# EAGLE design triface-final (EAGLE 7.2.0)
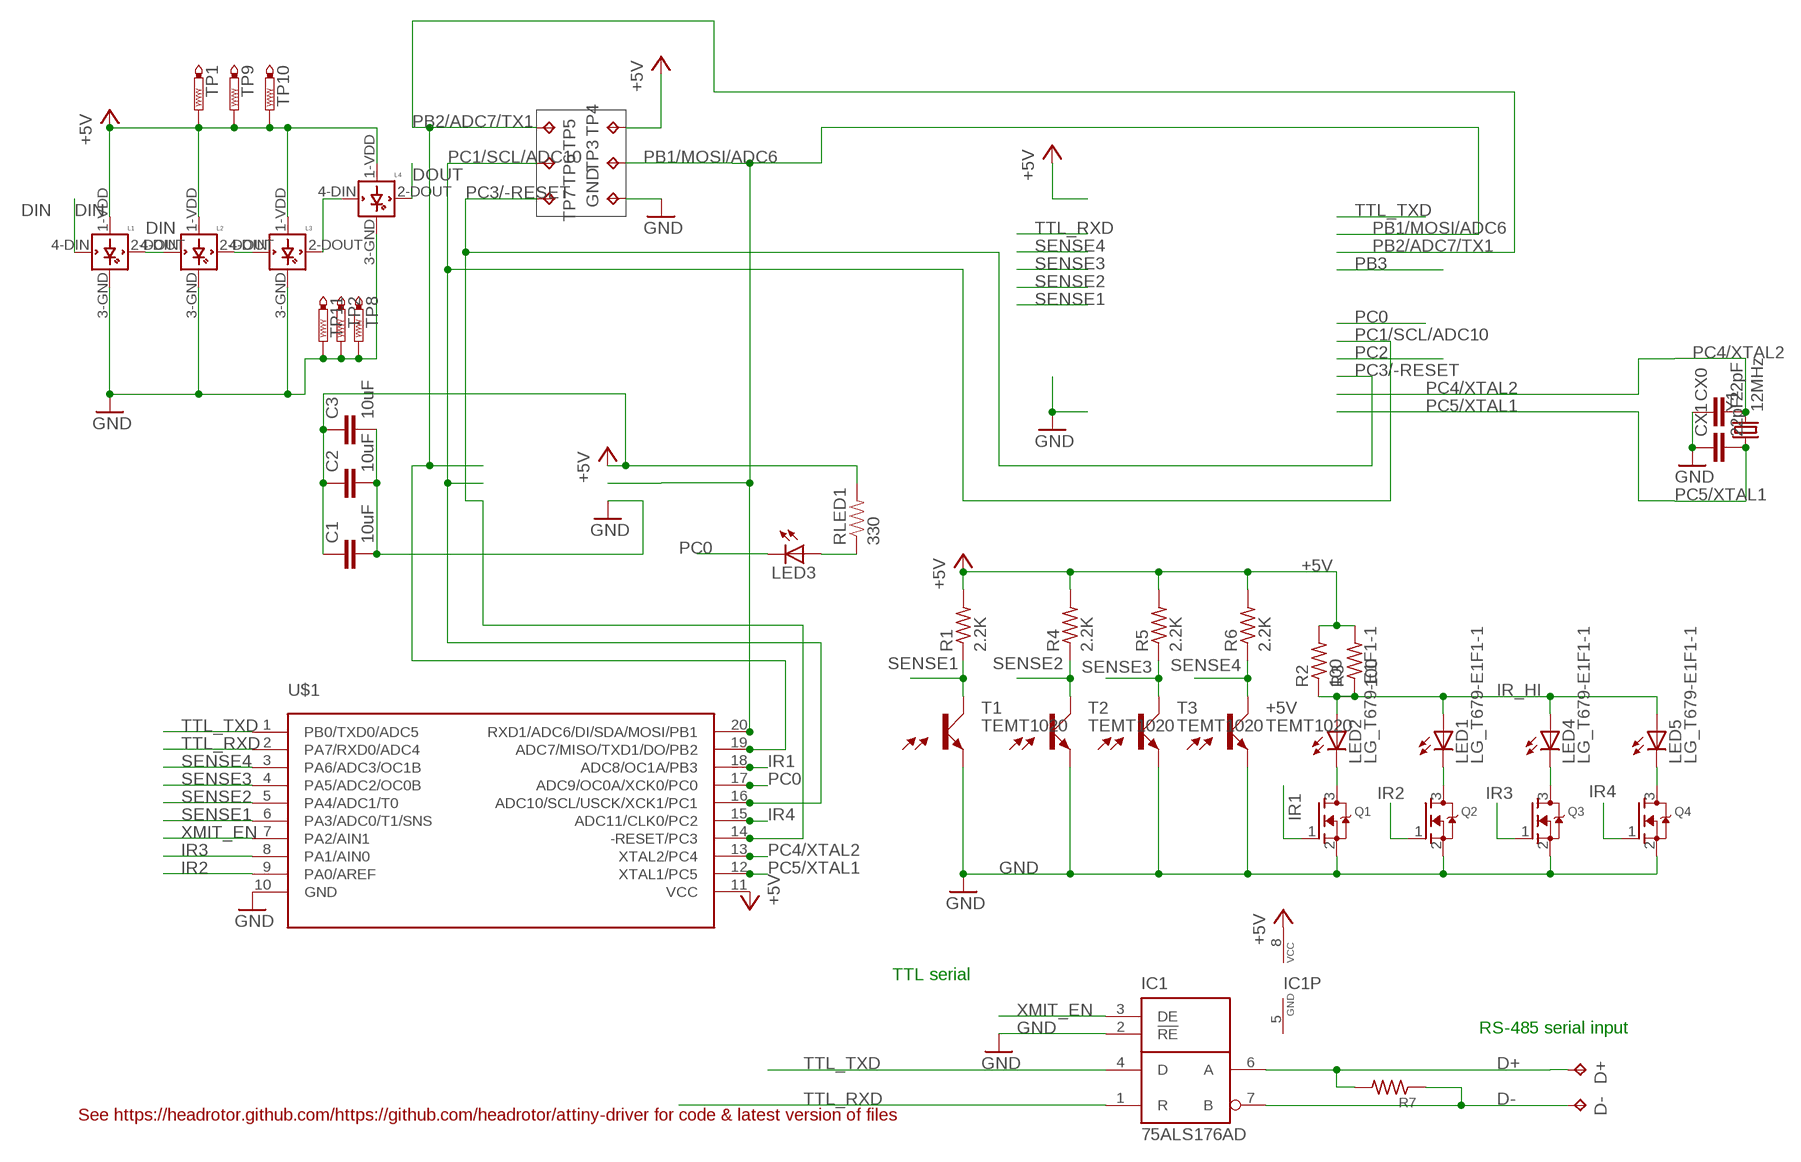
[diagram p0: schematic, sheet 1]

## Parts
+5V  TEMT1020  [TEMT1020]
C1  10uF  C-EUC0805  [C0805]
C2  10uF  C-EUC0805  [C0805]
C3  10uF  C-EUC0805  [C0805]
CX0  22pF  C-EUC0603  [C0603]
CX1  22pF  C-EUC0603  [C0603]
D+  TPTP14R  [TP14R]
D-  TPTP14SQ  [TP14SQ]
GND  TPTP12SQ  [TP12SQ]
IC1  75ALS176AD  [SO-08]
L1  WS2812B  [WS2812B]
L2  WS2812B  [WS2812B]
L3  WS2812B  [WS2812B]
L4  WS2812B  [WS2812B]
LED1  LG_T679-E1F1-1  [PLCC2]
LED2  LG_T679-E1F1-1  [PLCC2]
LED3  LED0603  [LED-0603]
LED4  LG_T679-E1F1-1  [PLCC2]
LED5  LG_T679-E1F1-1  [PLCC2]
Q1  MOSFET-NREFLOW  [SOT23]
Q2  MOSFET-NREFLOW  [SOT23]
Q3  MOSFET-NREFLOW  [SOT23]
Q4  MOSFET-NREFLOW  [SOT23]
R1  2.2K  R-US_R0603  [R0603]
R2  100  R-US_R0805  [R0805]
R3  100  R-US_R0805  [R0805]
R4  2.2K  R-US_R0603  [R0603]
R5  2.2K  R-US_R0603  [R0603]
R6  2.2K  R-US_R0603  [R0603]
R7  330  R-US_R0603  [R0603]
RLED1  330  RESISTOR0603-RES  [0603-RES]
T1  TEMT1020  [TEMT1020]
T2  TEMT1020  [TEMT1020]
T3  TEMT1020  [TEMT1020]
TP1  PTR1TP14SQ  [TP14SQ]
TP2  PTR1B2,54  [B2,54]
TP3  TPTP12R  [TP12R]
TP4  TPTP12R  [TP12R]
TP5  TPTP12R  [TP12R]
TP6  TPTP12R  [TP12R]
TP7  TPTP12R  [TP12R]
TP8  PTR1B2,54  [B2,54]
TP9  PTR1TP14SQ  [TP14SQ]
TP10  PTR1TP14SQ  [TP14SQ]
TP11  PTR1B2,54  [B2,54]
U$1  ATTINY1634  [SOIC20]
Y1  12MHz  CRYSTAL5X3  [CRYSTAL-SMD-5X3]

## Nets
+5V [POWER]: C1.1 C2.1 C3.1 IC1.8(VCC) L1.1-VDD(VDD) L2.1-VDD(VDD) L3.1-VDD(VDD) L4.1-VDD(VDD) R1.2 R2.2 R3.2 R4.2 R5.2 R6.2 RLED1.2 TP1.TP TP4.TP TP9.TP TP10.TP U$1.11(VCC)
D+: D+.TP IC1.6(A) R7.2
D-: D-.TP IC1.7(B) R7.1
DIN: L1.4-DIN(DIN)
DOUT: L4.2-DOUT(DOUT)
GND: +5V.E C1.2 C2.2 C3.2 CX0.1 CX1.1 GND.TP IC1.2(!RE) L1.3-GND(GND) L2.3-GND(GND) L3.3-GND(GND) L4.3-GND(GND) Q1.2(S) Q2.2(S) Q3.2(S) Q4.2(S) T1.E T2.E T3.E TP2.TP TP8.TP TP11.TP U$1.10(GND)
IR1: Q1.1(G) U$1.18(ADC8/OC1A/PB3)
IR2: Q2.1(G) U$1.9(PA0/AREF)
IR3: Q3.1(G) U$1.8(PA1/AIN0)
IR4: Q4.1(G) U$1.15(ADC11/CLK0/PC2)
IR_HI: LED1.A LED2.A LED4.A LED5.A R2.1 R3.1
N$2: LED2.C Q1.3(D)
N$4: LED1.C Q2.3(D)
N$5: L1.2-DOUT(DOUT) L2.4-DIN(DIN)
N$6: LED3.A RLED1.1
N$7: L2.2-DOUT(DOUT) L3.4-DIN(DIN)
N$8: L3.2-DOUT(DOUT) L4.4-DIN(DIN)
N$9: LED4.C Q3.3(D)
N$10: LED5.C Q4.3(D)
PB1/MOSI/ADC6: TP3.TP U$1.20(RXD1/ADC6/DI/SDA/MOSI/PB1)
PB2/ADC7/TX1: TP5.TP U$1.19(ADC7/MISO/TXD1/DO/PB2)
PC0: LED3.C U$1.17(ADC9/OC0A/XCK0/PC0)
PC1/SCL/ADC10: TP6.TP U$1.16(ADC10/SCL/USCK/XCK1/PC1)
PC3/-RESET: TP7.TP U$1.14(-RESET/PC3)
PC4/XTAL2: CX0.2 U$1.13(XTAL2/PC4) Y1.3
PC5/XTAL1: CX1.2 U$1.12(XTAL1/PC5) Y1.1
SENSE1: R1.1 T1.C U$1.6(PA3/ADC0/T1/SNS)
SENSE2: R4.1 T2.C U$1.5(PA4/ADC1/T0)
SENSE3: R5.1 T3.C U$1.4(PA5/ADC2/OC0B)
SENSE4: +5V.C R6.1 U$1.3(PA6/ADC3/OC1B)
TTL_RXD: IC1.1(R) U$1.2(PA7/RXD0/ADC4)
TTL_TXD: IC1.4(D) U$1.1(PB0/TXD0/ADC5)
XMIT_EN: IC1.3(DE) U$1.7(PA2/AIN1)

## Notes on the sheet
- TTL serial
- RS-485 serial input
- See https://headrotor.github.com/https://github.com/headrotor/attiny-driver for code & latest version of files

## Power pins joined to a net without a drawn wire
GND: IC1.5(GND)

## Library data of the parts
+5V T1-T3 = badge:TEMT1020
C1-C3 CX0 CX1 = rcl:C-EU: CAPACITOR, European symbol
D+ D- GND TP3-TP7 = testpad:TP: Test pad
IC1 = texas:75ALS176: DIFFERENTIAL BUS TRANSCEIVERS TIA/EIA-422-B, TIA/EIA-422-B + TIA/EIA-422-B TIA/EIA-422-B Operate at Data Rates up to 35 Mbaud Source: http://focus.ti.com/lit/ds/symlink/sn65als176.pdf
L1-L4 = adafruit:WS2812B
LED1 LED2 LED4 LED5 = led:*_T679-?-1: LC TOPLED® Low Current LED Source: http://catalog.osram-os.com .. LG_LS_LY_T679_OBS.pdf; COLOR: green
LED3 = SparkFun-LED:LED: LEDs Standard schematic elements and footprints for 5mm, 3mm, 1206, and 0603 sized LEDs. 5mm - Spark Fun Electronics SKU : COM-00529 (and others)
Q1-Q4 = adafruit:MOSFET-N: N-Channel Mosfet 2N7002E - 60V 260mA SOT23 [Digikey: 2N7002ET1GOSTR-ND] - REEL BSH103 - 30V 850mA SOT23 [Digikey: 568-5013-1-ND]
R1-R7 = rcl:R-US_: RESISTOR, American symbol
RLED1 = SparkFun-Passives:RESISTOR: Resistor Basic schematic elements and footprints for 0603, 1206, and PTH resistors.
TP1 TP2 TP8-TP11 = testpad:PTR1: TEST PIN
U$1 = attiny1634:ATTINY1634
Y1 = SparkFun-FreqCtrl:CRYSTAL: Various standard crystals. Proven footprints. Spark Fun Electronics SKU : COM-00534

## Net classes
1 POWER: width 0.254 mm

## Board
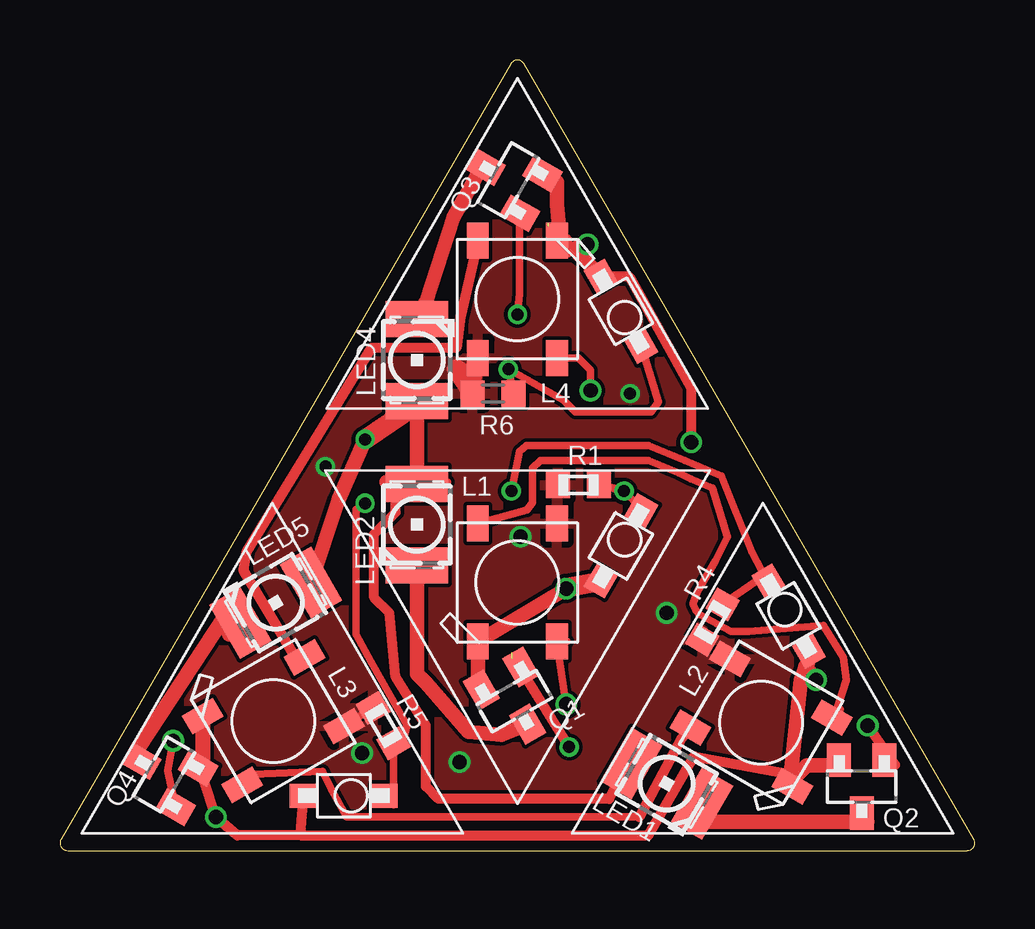
[diagram p1: board, top side]
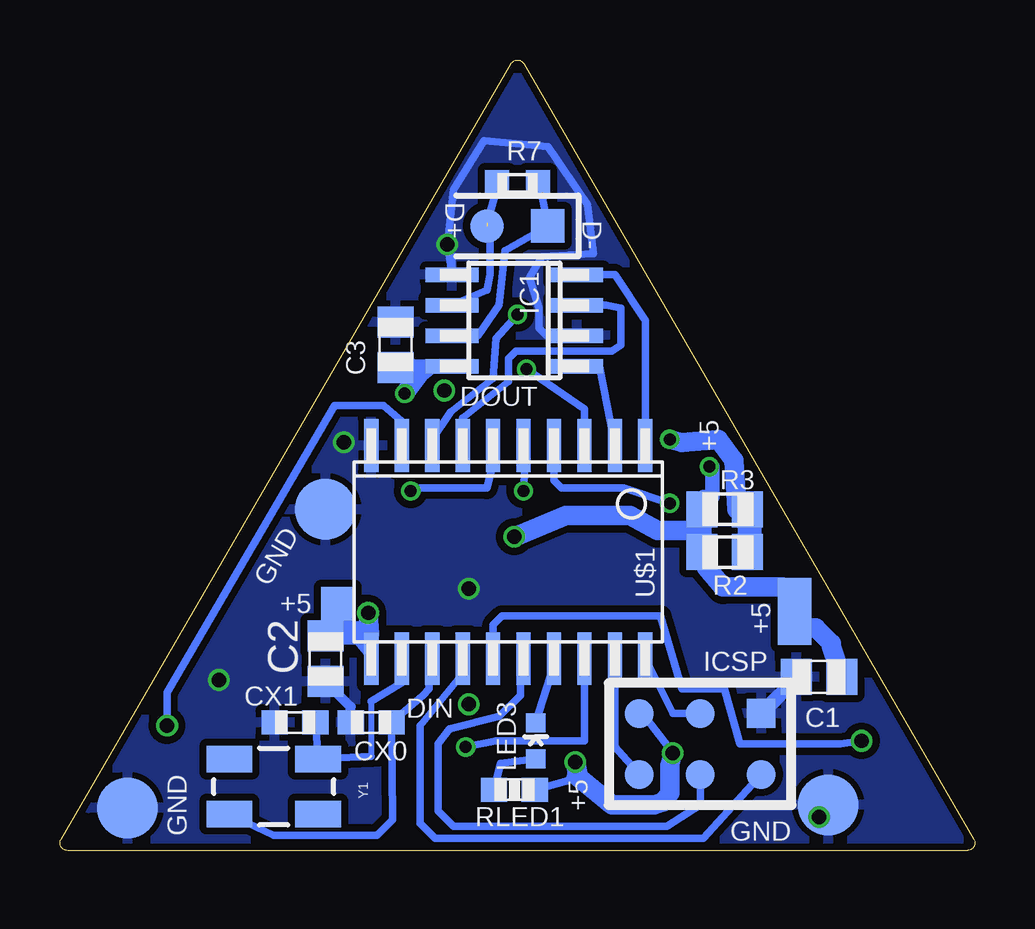
[diagram p2: board, bottom side, seen from below]

Size 38.14 x 32.96 mm. Coordinates in mm from the lower left corner, seen from the top.
Outline: 18.79,32.8 0.04,0.48 arc120 0.32,0 37.82,0 arc120 38.1,0.48 19.34,32.8 arc120 18.79,32.8
Copper layers (1*16): Top 0.035mm / dielectric 1.5mm / Bottom 0.035mm
Design rules "SeeedStudio_2layer_DRU_no_angle_20140221": minimum track width 6mil, minimum drill 12mil, track to track 6mil, track to pad 6mil, pad to pad 6mil, via to via 6mil, smd to smd 0mil, copper to edge 10mil, drill to drill 10mil, minimum pad ring 10mil, minimum via ring 6mil, stop-mask expansion 2mil, vias tented up to drill 100mil, thermal gap 10mil

### Footprints (pad centres in the part's own frame; a part is rotated, then mirrored left to right if it is on the bottom)
TEMT1020 = smd 1.1 x 1: C -1.7,0; E 1.7,0
C0805 = smd 1.3 x 1.5: 1 -0.95,0; 2 0.95,0
C0603 = smd 1.1 x 1: 1 -0.85,0; 2 0.85,0
TP14R = smd 1.4 x 1.4: TP 0,0
TP14SQ = smd 1.4 x 1.4: TP 0,0
TP12SQ = smd 1.2 x 1.2: TP 0,0
SO-08 = smd 0.6 x 2.2: 1 -1.905,-2.6; 2 -0.635,-2.6; 3 0.635,-2.6; 4 1.905,-2.6; 5 1.905,2.6; 6 0.635,2.6; 7 -0.635,2.6; 8 -1.905,2.6
WS2812B = smd 1.5 x 0.9: 1-VDD 2.45,-1.65; 2-DOUT 2.45,1.65; 3-GND -2.45,1.65; 4-DIN -2.45,-1.65
PLCC2 = smd 2.6 x 1.5: A 0,1.7; C 0,-1.7
LED-0603 = smd 0.8 x 0.8: A 0,-0.75; C 0,0.75
SOT23 = smd 1 x 1.4: 1 -0.95,-1.1; 2 0.95,-1.1; 3 0,1.1
R0603 = smd 1 x 1.1: 1 -0.85,0; 2 0.85,0
R0805 = smd 1.3 x 1.5: 1 -0.95,0; 2 0.95,0
0603-RES = smd 1.1 x 1: 1 -0.85,0; 2 0.85,0
B2,54 = smd 2.54 x 2.54: TP 0,0
TP12R = smd 1.2 x 1.2: TP 0,0
SOIC20 = smd 0.6 x 2.2: 1 -1.905,-4.445; 2 -0.635,-4.445; 3 0.635,-4.445; 4 1.905,-4.445; 5 3.175,-4.445; 6 4.445,-4.445; 7 5.715,-4.445; 8 6.985,-4.445; 9 8.255,-4.445; 10 9.525,-4.445; 11 9.525,4.445; 12 8.255,4.445; 13 6.985,4.445; 14 5.715,4.445; 15 4.445,4.445; 16 3.175,4.445; 17 1.905,4.445; 18 0.635,4.445; 19 -0.635,4.445; 20 -1.905,4.445
CRYSTAL-SMD-5X3 = smd 1.9 x 1.1: 1 -1.85,-1.15; 2 1.85,-1.15; 3 1.85,1.15; 4 -1.85,1.15

### Placement (x,y rotation side)
+5V  23.39,22.48 120 top
C1  6.5,7.24 180 bottom
C2  27.07,8 270 bottom
C3  24.15,21.08 90 bottom
CX0  25.17,5.33 0 bottom
CX1  28.34,5.33 0 bottom
D+  20.34,26.04 0 bottom
D-  17.8,26.04 0 bottom
GND  8.91,5.71 0 bottom
IC1  19.2,22.1 90 bottom
L1  19.07,11.18 90 top
L2  29.23,5.33 150 top
L3  8.89,5.4 30 top
L4  19.07,22.99 270 top
LED1  25.29,2.79 60 top
LED2  14.88,13.59 0 top
LED3  18.31,4.57 0 bottom
LED4  14.88,20.45 180 top
LED5  8.99,10.33 300 top
Q1  18.94,6.22 210 top
Q2  33.42,2.67 180 top
Q3  18.69,27.94 60 top
Q4  4.34,3.17 60 top
R1  21.61,15.24 180 top
R2  10.43,12.45 180 bottom
R3  10.43,14.22 180 bottom
R4  27.2,9.53 240 top
R5  13.48,5.21 120 top
R6  18.05,19.05 180 top
R7  19.07,27.81 180 bottom
RLED1  19.2,2.54 0 bottom
T1  23.39,12.7 240 top
T2  30.37,9.78 300 top
T3  11.83,2.29 180 top
TP1  7.51,10.67 270 bottom
TP2  35.33,1.78 0 bottom
TP3  11.45,5.71 0 bottom
TP4  13.99,5.71 0 bottom
TP5  13.99,3.17 0 bottom
TP6  11.45,3.17 0 bottom
TP7  8.91,3.17 0 bottom
TP8  6.12,1.91 0 bottom
TP9  7.51,9.27 0 bottom
TP10  26.56,10.29 0 bottom
TP11  27.07,14.22 0 bottom
U$1  15.64,12.45 180 bottom
Y1  29.23,2.67 180 bottom

### Tracks (layer width: path | path; a pad name or v marks a point on that pad's centre or on a via)
+5V  (via drill 0.5, 0.6)
  Top 0.305: R5.2 L3.1-VDD
  Top 0.813: R6.2 16.53,20.07 17.16,19.68 L4.1-VDD
  Bottom 0.305: U$1.11 26.31,9.4 25.29,9.4 v25.29,9.91 | IC1.8 22.37,20.19 v23.77,19.05 | TP4.TP 13.86,5.71 v12.59,4.06 | RLED1.2 16.91,2.92 v16.66,3.68
  Bottom 0.61: v11.07,16 10.94,16 10.94,14.73 11.32,14.73 11.45,14.61 11.45,14.48
  Bottom 0.813: v19.2,13.08 17.04,13.97 14.37,13.97 13.23,13.34 11.45,13.34 | 11.45,13.34 R3.2 R2.2 11.2,11.81 10.5,10.99 8.02,10.99 TP1.TP TP9.TP 6.62,9.27 5.99,8.64 5.99,8.51 5.61,7.37 5.61,7.3 C1.1 | v16.66,3.68 16.53,3.05 15.13,1.91 13.35,1.91 12.97,2.03 12.72,2.41 12.72,3.56 v12.59,4.06 | v25.29,9.91 25.23,9.02 C2.1 | 11.45,14.48 11.45,13.34 | 26.31,9.4 26.31,10.03 TP10.TP | v23.77,19.05 23.01,20.07 C3.1
  pour Top (isolate 0.152): -3.79,-1.91 40.66,-1.91 40.66,10.79 40.66,34.93 -3.79,34.93
D+  (1 unrouted)
  Bottom 0.305: IC1.6 20.34,23.37 20.21,24 20.21,26.16 20.34,25.65 20.34,26.16 19.83,27.9 R7.2
D-
  Bottom 0.305: R7.1 18.18,27.94 D-.TP 19.58,25.02 19.83,22.73 20.72,21.46 IC1.7
DIN  (via drill 0.6)  (1 unrouted)
  Top 0.305: L1.4-DIN 21.14,8.73 | v21.1,6.1 20.72,8.64
DOUT  (via drill 0.6)
  Top 0.305: L4.2-DOUT 21.06,20.54 | 21.06,20.54 21.61,20.54 | 21.61,20.54 21.06,20.54 | v22.12,19.18 22.12,20.03 21.61,20.54
GND  (via drill 0.6)
  Top 0.406: +5V.E 23.69,23.95 23.77,23.88 26.31,19.3 v26.31,17.02 | 10.05,0.64 24.53,0.64 26.44,3.94 30.5,3.17 | T3.E 10,0.68 10.05,0.64 | 10.05,0.64 7.39,0.64 v6.5,1.4 5.99,2.92 5.99,3.3 6.06,3.37 6.06,5.71
  Top 0.61: Q4.2 5.95,3.5 L3.3-GND 6.06,5.71 | T2.E 31.19,8.05 31.19,7.8 31.07,7.68 | 31.39,7.11 30.88,7.11 | 30.88,7.11 30.5,3.43 30.5,3.17 30.37,2.83 L2.3-GND 30.53,2.95 31.13,3.56 32.43,3.56 Q2.2 | 19.94,28.21 Q3.2 20.72,27.86 20.72,26.92 20.85,25.53 20.72,25.56 L4.3-GND | L4.3-GND 21.05,25.44 | 21.15,10.97 21.19,10.97 L1.3-GND 17.42,7.11 17.57,6.96 Q1.2 | 31.07,7.68 30.88,7.11 | +5V.E 21.61,24.88 v21.99,25.27 21.14,25.02 L4.3-GND | v31.52,7.11 31.07,7.68
  Top 0.813: T1.E 21.15,10.97 v21.1,10.92
  Bottom 0.305: v21.99,25.27 21.8,24.83 IC1.5 v21.99,25.27 | IC1.2 17.86,21.46 18.18,21.78 18.18,22.61 18.56,23.88 18.05,24.76 15.89,24.89 16.15,26.92 17.8,29.34 20.47,29.59 21.74,27.56 v21.99,25.27
  Bottom 0.406: CX0.1 26.02,6 C2.2
  Bottom 0.61: C1.2 8.15,6.48 GND.TP
  pour Bottom (isolate 0.305): -2.52,-1.91 41.93,-1.91 41.93,36.2 -2.52,36.2
IR1  (via drill 0.5)
  Top 0.406: Q1.1 19.29,7.4 v21.23,4.32
  Bottom 0.305: U$1.18 16.28,7.24 16.28,7.11 16.28,4.57 18.69,4.57 19.96,4.57 v21.23,4.32
IR2  (via drill 0.6)
  Top 0.406: v33.67,5.21 34.82,3.56 34.82,3.57 Q2.1
  Bottom 0.305: v33.67,5.21 33.67,6.6 26.69,18.54 24.66,18.54 23.9,17.91 U$1.9
IR3  (via drill 0.5)
  Top 0.305: Q3.1 19.17,23.21 v19.07,22.35
  Bottom 0.305: v19.07,22.35 19.96,21.34 20.09,19.68 21.86,18.29 22.63,17.14 U$1.8
IR4  (via drill 0.6)
  Top 0.305: Q4.1 4.49,3.33 v4.72,4.57
  Bottom 0.305: U$1.15 20.09,9.4 19.7,9.78 13.99,9.78 13.1,9.78 12.21,6.73 11.07,6.73 10.43,6.73 9.8,4.45 8.66,4.45 5.61,4.45 v4.72,4.57
IR_HI  (via drill 0.5)
  Top 0.305: LED2.A 14.62,15.04 16.02,15.04 16.02,15.37 16.15,15.37
  Top 0.406: LED1.A 23.26,3.64 23.26,2.91 22.89,2.15 15.77,2.16 15.26,2.67 15.26,5.21 13.99,7.24 13.74,9.91 13.1,10.54 13.1,13.21 13.99,14.1 13.99,15.24
  Top 0.61: LED4.A LED2.A 14.83,15.24 14.12,15.24 | LED5.A 11.61,14.63 v12.72,17.14 | 14.12,15.24 13.61,15.37 | 13.99,15.24 14.12,15.24
  Top 0.813: v12.72,17.14 14.8,18.54 LED4.A
  Bottom 0.813: R3.1 R2.1 9.36,12.63 9.29,12.7 9.29,14.22 9.42,14.35 9.8,14.35 9.93,14.22 10.05,16.26 10.69,17.14 12.21,17.02 v12.72,17.14
N$2
  Top 0.61: LED2.C 14.88,7.37 15.26,6.99 17.04,4.95 18.41,4.83 Q1.3
N$4
  Top 0.305: LED1.C 27.02,1.2
  Top 0.61: 27.02,1.2 33.67,1.2 Q2.3
N$5
  Top 0.305: 32.53,5.89 L2.4-DIN 32.3,5.61 32.79,7.11 32.66,8.04 31.81,9.38 28.72,9.14 27.96,9.14 26.65,9.85 26.5,10.01 26.39,10.29 26.56,10.79 27.32,12.06 27.83,13.08 27.2,15.11 26.31,15.49 25.8,15.75 24.53,16.26 20.72,16.26 20.02,16.26 19.7,15.94 19.7,14.5 19.47,14.2 L1.2-DOUT
N$6
  Bottom 0.305: RLED1.1 19.78,3.64 LED3.A
N$7
  Top 0.305: 24.15,1.4 11.96,1.4 11.32,2.54 10.94,3.3 8.03,3.17 L3.4-DIN
  Top 0.406: L2.2-DOUT 25.9,4.67 24.15,1.4
N$8
  Top 0.406: L4.4-DIN 16.69,22.26 16.53,20.95 12.97,20.95 7.77,12.45 7.64,11.68 9.8,8.06 L3.2-DOUT
N$9
  Top 0.61: LED4.C 14.75,22.1 15.26,22.86 16.4,26.42 17.55,28.45 17.69,28.57 Q3.3
N$10
  Top 0.61: Q4.3 3.26,4.25 6.88,9.78 7.05,9.02 LED5.C
PB1/MOSI/ADC6
  Bottom 0.305: U$1.20 12.59,5.71 TP3.TP
PB2/ADC7/TX1
  Bottom 0.305: U$1.19 15.01,6.99 15.01,4.32 TP5.TP
PC0
  Bottom 0.305: U$1.17 17.55,7.73 LED3.C
PC1/SCL/ADC10  (1 unrouted)
  Bottom 0.305: 18.82,8.64 U$1.16 | 18.82,8.26 18.94,7.75 18.94,6.48 19.83,5.59 21.89,5.07 22.37,4.46 22.37,1.65 21.74,1.02 12.85,1.02 11.45,1.91 TP6.TP
PC3/-RESET
  Bottom 0.305: TP7.TP 11.32,0.51 22.5,0.51 23.13,1.14 23.13,5.21 21.36,7.37 U$1.14
PC4/XTAL2
  Bottom 0.305: U$1.13 22.75,8.13 22.75,6.73 23.01,6.48 CX0.2 24.28,1.27 24.92,0.64 29.23,0.64 Y1.3
PC5/XTAL1
  Bottom 0.254: 25.17,6.22 25.17,3.94
  Bottom 0.305: U$1.12 23.9,6.99 25.17,6.22 | 25.17,3.94 Y1.1 CX1.2
SENSE1  (via drill 0.5)
  Top 0.305: v23.51,14.99 22.5,15.28 | 22.5,15.28 R1.1 | 22.5,15.28 23.64,14.9 T1.C
  Bottom 0.305: U$1.6 20.09,16.13 20.34,15.11 23.13,15.11 v23.51,14.99
SENSE2  (via drill 0.5)
  Top 0.305: R4.1 29.3,11.43 29.6,11.18 T2.C 29.48,11.21 28.85,12.45 27.58,15.62 26.05,16.26 24.53,16.89 20.09,16.89 19.46,16.89 19.15,16.64 v18.82,14.99
  Bottom 0.305: v18.82,14.99 18.69,17.02 U$1.5
SENSE3  (via drill 0.5)
  Top 0.305: 13.1,1.95 T3.C 13.91,1.91 13.91,3.98 R5.1 13.99,4.55 14.37,4.79 14.48,5.22 12.97,7.87 12.34,9.02 12.34,14.22 v12.72,14.48
  Bottom 0.305: v12.72,14.48 14.62,15.11 17.23,15.11 17.55,15.43 17.55,17.4 U$1.4
SENSE4  (via drill 0.5)
  Top 0.305: +5V.C 24.95,18.7 24.64,18.29 21.48,18.29 21.02,18.75 v18.69,20.07 R6.1
  Bottom 0.305: U$1.3 16.28,18.41 v18.69,20.07
TTL_RXD
  Bottom 0.305: IC1.1 15.64,20.19 U$1.2
TTL_TXD
  Bottom 0.305: IC1.4 15.01,24 13.74,22.1 U$1.1
XMIT_EN
  Bottom 0.305: IC1.3 15.39,22.73 14.75,22.61 14.75,21.08 15.13,20.83 19.13,20.83 19.45,20.51 19.45,19.56 21.36,18.03 U$1.7

### Text on the board
bNames: DOUT | +5 | GND | +5 | +5 | ICSP | DIN | GND | +5